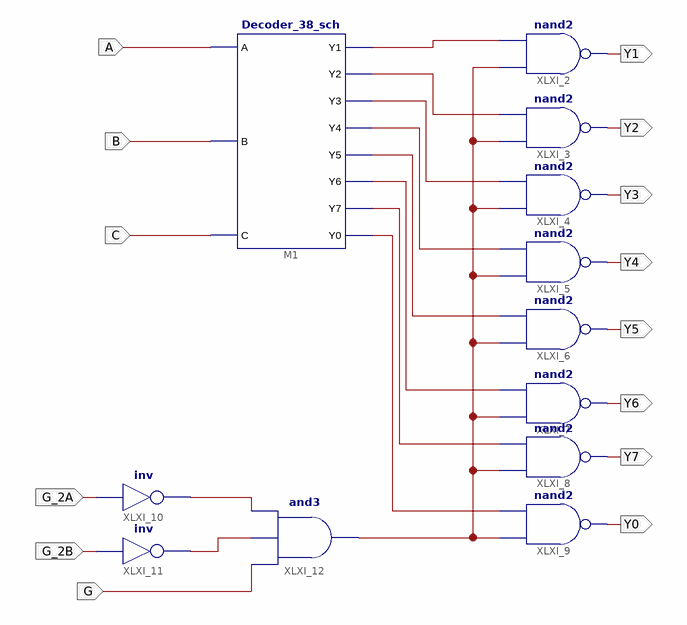
[diagram p0: schematic sheet 1]
// Xilinx ISE schematic HTC138.sch (kintex7) as structural Verilog: 12 symbols, 14 ports
module HTC138 (
  input  A,
  input  B,
  input  C,
  input  G,
  input  G_2A,
  input  G_2B,
  output Y0,
  output Y7,
  output Y6,
  output Y5,
  output Y4,
  output Y3,
  output Y2,
  output Y1
);

  wire XLXN_4, XLXN_5, XLXN_6, XLXN_7, XLXN_8, XLXN_9, XLXN_10, XLXN_11, XLXN_12, XLXN_13, XLXN_23;

  Decoder_38_sch M1 (
    .A(A), .B(B), .C(C), .Y1(XLXN_4), .Y2(XLXN_5), .Y3(XLXN_6), .Y4(XLXN_7), .Y5(XLXN_8), .Y6(XLXN_9),
    .Y7(XLXN_10), .Y0(XLXN_11));
  nand XLXI_2 (Y1, XLXN_23, XLXN_4);
  nand XLXI_3 (Y2, XLXN_23, XLXN_5);
  nand XLXI_4 (Y3, XLXN_23, XLXN_6);
  nand XLXI_5 (Y4, XLXN_23, XLXN_7);
  nand XLXI_6 (Y5, XLXN_23, XLXN_8);
  nand XLXI_7 (Y6, XLXN_23, XLXN_9);
  nand XLXI_8 (Y7, XLXN_23, XLXN_10);
  nand XLXI_9 (Y0, XLXN_23, XLXN_11);
  not XLXI_10 (XLXN_12, G_2A);
  not XLXI_11 (XLXN_13, G_2B);
  and XLXI_12 (XLXN_23, G, XLXN_13, XLXN_12);
endmodule
